# Altium project SpaceSalmon.PrjPcb (part 1 of 2)
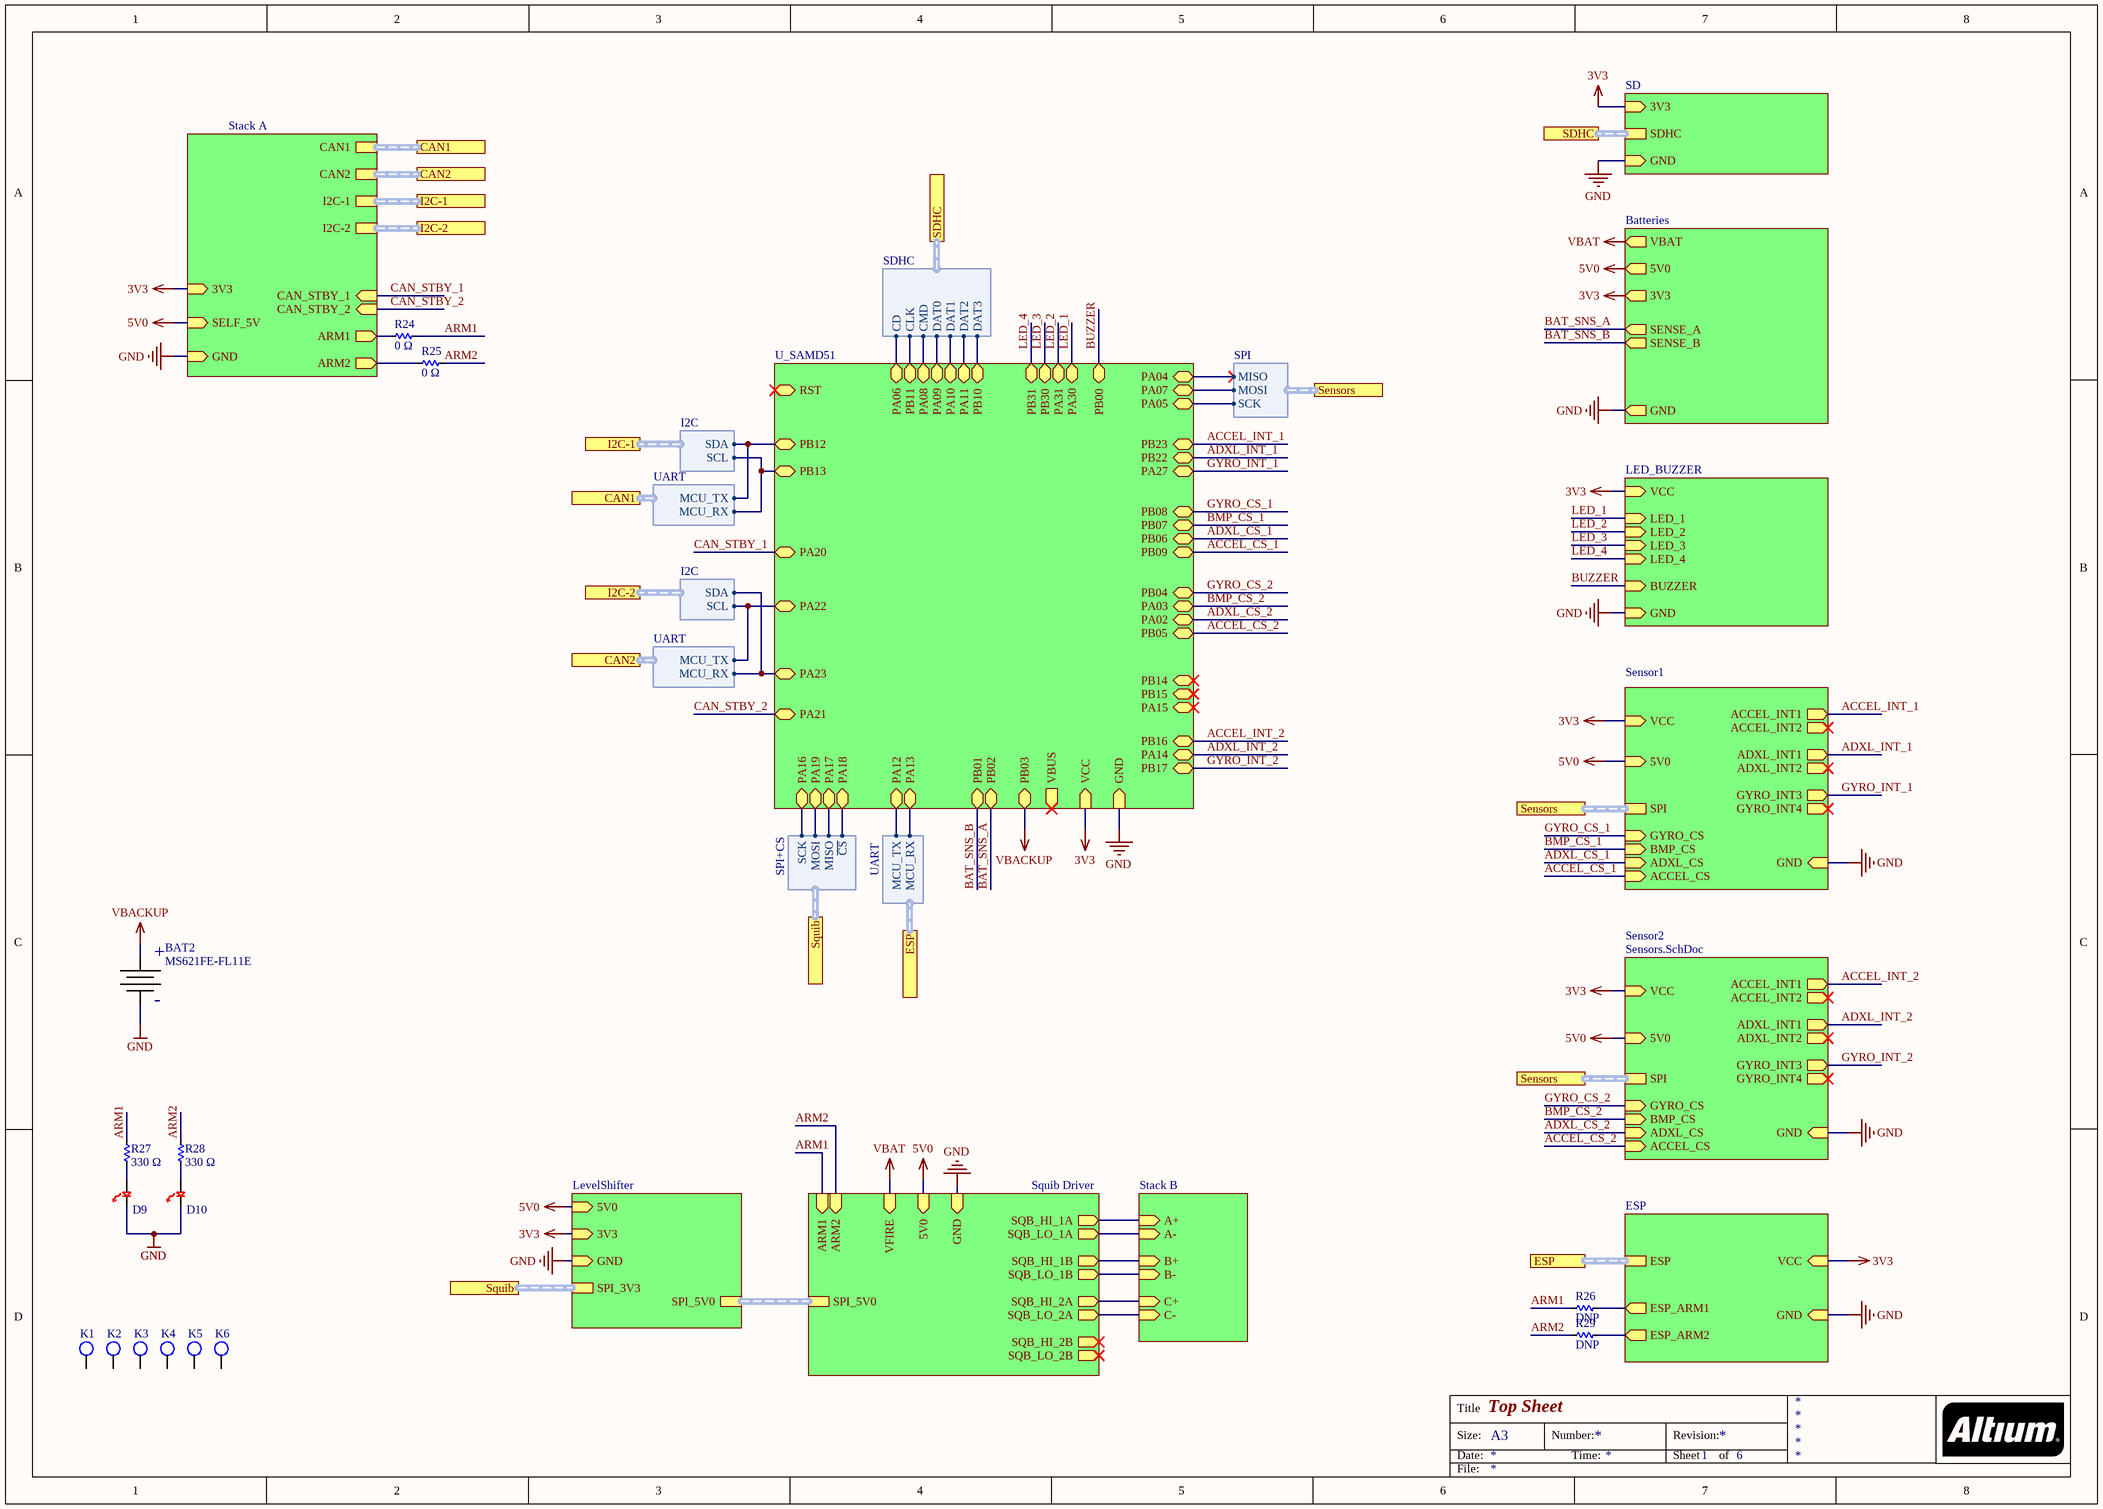
[diagram p0: Salmon.SchDoc]
prjEngineer1: John Dean; prjEngineer2: Rebecca Wong; prjReviewDate: 2016-10-31; prjReviewer: Sasha Maldonado; prjRevision: 0; prjTitle: IREC SRAD Altimeter
10 sheets, 173 parts. Net scope: strictly hierarchical (ports join the sheet entries above them; power ports are local).
Board file: Salmon.PcbDoc
Sheets:
  Salmon.SchDoc
    Sensor1 = Sensors.SchDoc
    Batteries = Battery_Management.SchDoc
    LED_BUZZER = Blink_Blink_Beep_Boop.SchDoc
    ESP = ESP8266.SchDoc
    U_SAMD51 = SAMD51.SchDoc
    Sensor2 = Sensors.SchDoc
    Stack B = Stack_B.SchDoc
    Stack A = Stack_A.SchDoc
    Squib Driver = MC33797.SchDoc
    SD = SD.SchDoc

## Sheet Salmon.SchDoc: Top Sheet
size A3; SheetNumber: 1; SheetTotal: 6; DocumentName: Top Sheet

### Parts
BAT2  MS621FE-FL11E  [BATT_COINCELL_RECHARGEABLE]
D9  RED  [0805_Diode]  (value not drawn)
D10  RED  [0805_Diode]  (value not drawn)
K1  92985A610  [#4_PRESSFIT_FOOT_1/4]  (value not drawn)
K2  92985A610  [#4_PRESSFIT_FOOT_1/4]  (value not drawn)
K3  92985A610  [#4_PRESSFIT_FOOT_1/4]  (value not drawn)
K4  92985A610  [#4_PRESSFIT_FOOT_1/4]  (value not drawn)
K5  92985A610  [#4_PRESSFIT_FOOT_1/4]  (value not drawn)
K6  92985A610  [#4_PRESSFIT_FOOT_1/4]  (value not drawn)
R24  Resistance: 0 Ω  [R0603]  (hidden comment: __template_resistor)
R25  Resistance: 0 Ω  [R0603]  (hidden comment: __template_resistor)
R26  Resistance: DNP  [R0603]  (hidden comment: __template_resistor)
R27  Resistance: 330 Ω  [R0603]  (hidden comment: __template_resistor)
R28  Resistance: 330 Ω  [R0603]  (hidden comment: __template_resistor)
R29  Resistance: DNP  [R0603]  (hidden comment: __template_resistor)

### Sub-sheets
Batteries = Battery_Management: SENSE_A (out), SENSE_B (out), 5V0 (out), GND (out), 3V3 (out), VBAT (out)
ESP = ESP8266.SchDoc: ESP_ARM2 (out), ESP_ARM1 (out), VCC (in), GND (in), ESP (harness UART)
LED_BUZZER = Blink_Blink_Beep_Boop: LED_1 (in), LED_2 (in), LED_3 (in), LED_4 (in), BUZZER (in), GND (in), VCC (in)
LevelShifter = LevelShifter.SchDoc (file not in this document): SPI_3V3 (harness SPI+CS), SPI_5V0 (harness SPI+CS), 5V0 (in), 3V3 (in), GND (in)
SD = SD.SchDoc: SDHC (harness SDHC), GND (in), 3V3 (in)
Sensor1 = Sensors.SchDoc: SPI (harness SPI), GYRO_CS (in), BMP_CS (in), ADXL_CS (in), ACCEL_CS (in), ACCEL_INT1 (out), ACCEL_INT2 (out), ADXL_INT1 (out), ADXL_INT2 (out), GYRO_INT3 (out), GYRO_INT4 (out), GND (in), VCC (in), 5V0 (in)
Sensor2 = Sensors.SchDoc: SPI (harness SPI), GYRO_CS (in), BMP_CS (in), ADXL_CS (in), ACCEL_CS (in), ACCEL_INT1 (out), ACCEL_INT2 (out), ADXL_INT1 (out), ADXL_INT2 (out), GYRO_INT3 (out), GYRO_INT4 (out), GND (in), VCC (in), 5V0 (in)
Squib Driver = MC33797.SchDoc: SPI_5V0 (harness SPI+CS), SQB_LO_1A (out), SQB_HI_1A (out), SQB_LO_1B (out), SQB_HI_1B (out), SQB_HI_2A (out), SQB_LO_2A (out), ARM1 (in), ARM2 (in), 5V0 (in), VFIRE (in), GND (in), SQB_HI_2B (out), SQB_LO_2B (out)
Stack A = Stack_A.SchDoc: CAN2 (harness UART), I2C-2 (harness I2C), I2C-1 (harness I2C), CAN1 (harness UART), CAN_STBY_2 (in), CAN_STBY_1 (in), ARM1 (out), ARM2 (out), GND (in), SELF_5V (in), 3V3 (in)
Stack B = Stack_B.SchDoc: B- (in), C+ (in), B+ (in), A- (in), A+ (in), C- (in)
U_SAMD51 = SAMD51.SchDoc: PA12 (bidir), PA13 (bidir), PA05 (bidir), PA07 (bidir), PA04 (bidir), PA06 (bidir), PB11 (bidir), PA08 (bidir), PA09 (bidir), PA10 (bidir), PA11 (bidir), PB10 (bidir), PB12 (bidir), PB13 (bidir), PA22 (bidir), PA23 (bidir), PA16 (bidir), PA19 (bidir), PA17 (bidir), PA20 (bidir), PA21 (bidir), PB08 (bidir), PB07 (bidir), PB06 (bidir), PB09 (bidir), PB04 (bidir), PA03 (bidir), PA02 (bidir), PB05 (bidir), PB00 (bidir), PB30 (bidir), PA31 (bidir), PA30 (bidir), PB31 (bidir), PB16 (bidir), PA14 (bidir), PB17 (bidir), PB23 (bidir), PB22 (bidir), PA27 (bidir), PB02 (bidir), PB01 (bidir), PB03 (bidir), PA18 (bidir), GND (in), VCC (in), VBUS (out), PB14 (bidir), PB15 (bidir), PA15 (bidir), RST (bidir)

### Ports
CAN1 (harness UART), CAN2 (harness UART), ESP (harness UART), I2C-1 (harness I2C), I2C-2 (harness I2C), SDHC, SDHC (harness SDHC), Sensors (harness SPI), Squib (harness SPI+CS)

### Harnesses
UART: MCU_TX, MCU_RX
SPI: MISO, MOSI, SCK
SDHC: CD, CLK, CMD, DAT0, DAT1, DAT2, DAT3
I2C: SCL, SDA
UART: MCU_RX, MCU_TX
SPI+CS: MISO, MOSI, SCK, ~{CS}

### Nets
3V3: sheet Sensor1/VCC, sheet Batteries/3V3, sheet LED_BUZZER/VCC, sheet ESP/VCC, sheet U_SAMD51/VCC, sheet Sensor2/VCC, sheet Stack A/3V3, sheet LevelShifter/3V3, sheet SD/3V3
5V0: sheet Sensor1/5V0, sheet Batteries/5V0, sheet Sensor2/5V0, sheet Stack A/SELF_5V, sheet Squib Driver/5V0, sheet LevelShifter/5V0
GND: BAT2.- D9.1 D10.1 ; sheet Sensor1/GND, sheet Batteries/GND, sheet LED_BUZZER/GND, sheet ESP/GND, sheet U_SAMD51/GND, sheet Sensor2/GND, sheet Stack A/GND, sheet Squib Driver/GND, sheet LevelShifter/GND, sheet SD/GND  [project net SELF_GND]
VBACKUP: BAT2.+ ; sheet U_SAMD51/PB03
VBAT: sheet Batteries/VBAT, sheet Squib Driver/VFIRE
ACCEL_CS_1: sheet Sensor1/ACCEL_CS, sheet U_SAMD51/PB09
ACCEL_CS_2: sheet U_SAMD51/PB05, sheet Sensor2/ACCEL_CS
ACCEL_INT_1: sheet Sensor1/ACCEL_INT1, sheet U_SAMD51/PB23
ACCEL_INT_2: sheet U_SAMD51/PB16, sheet Sensor2/ACCEL_INT1
ADXL_CS_1: sheet Sensor1/ADXL_CS, sheet U_SAMD51/PB06
ADXL_CS_2: sheet U_SAMD51/PA02, sheet Sensor2/ADXL_CS
ADXL_INT_1: sheet Sensor1/ADXL_INT1, sheet U_SAMD51/PB22
ADXL_INT_2: sheet U_SAMD51/PA14, sheet Sensor2/ADXL_INT1
ARM1: R24.2 R26.1 R27.2 ; sheet Squib Driver/ARM1
ARM2: R25.2 R28.2 R29.1 ; sheet Squib Driver/ARM2
BAT_SNS_A: sheet Batteries/SENSE_A, sheet U_SAMD51/PB02
BAT_SNS_B: sheet Batteries/SENSE_B, sheet U_SAMD51/PB01
BMP_CS_1: sheet Sensor1/BMP_CS, sheet U_SAMD51/PB07
BMP_CS_2: sheet U_SAMD51/PA03, sheet Sensor2/BMP_CS
BUZZER: sheet LED_BUZZER/BUZZER, sheet U_SAMD51/PB00
CAN_STBY_1: sheet U_SAMD51/PA20, sheet Stack A/CAN_STBY_1
CAN_STBY_2: sheet U_SAMD51/PA21, sheet Stack A/CAN_STBY_2
GYRO_CS_1: sheet Sensor1/GYRO_CS, sheet U_SAMD51/PB08
GYRO_CS_2: sheet U_SAMD51/PB04, sheet Sensor2/GYRO_CS
GYRO_INT_1: sheet Sensor1/GYRO_INT3, sheet U_SAMD51/PA27
GYRO_INT_2: sheet U_SAMD51/PB17, sheet Sensor2/GYRO_INT3
LED_1: sheet LED_BUZZER/LED_1, sheet U_SAMD51/PA30
LED_2: sheet LED_BUZZER/LED_2, sheet U_SAMD51/PA31
LED_3: sheet LED_BUZZER/LED_3, sheet U_SAMD51/PB30
LED_4: sheet LED_BUZZER/LED_4, sheet U_SAMD51/PB31
MISO: sheet U_SAMD51/PA04, port Sensors.MISO
MOSI: sheet U_SAMD51/PA07, port Sensors.MOSI
SCK: sheet U_SAMD51/PA05, port Sensors.SCK
SD_CD: sheet U_SAMD51/PA06, port SDHC.CD
SD_CLK: sheet U_SAMD51/PB11, port SDHC.CLK
SD_CMD: sheet U_SAMD51/PA08, port SDHC.CMD
SD_DAT0: sheet U_SAMD51/PA09, port SDHC.DAT0
SD_DAT1: sheet U_SAMD51/PA10, port SDHC.DAT1
SD_DAT2: sheet U_SAMD51/PA11, port SDHC.DAT2
SD_DAT3: sheet U_SAMD51/PB10, port SDHC.DAT3
SELF_A+: sheet Stack B/A+, sheet Squib Driver/SQB_HI_1A
SELF_A-: sheet Stack B/A-, sheet Squib Driver/SQB_LO_1A
SELF_ARM1: R24.1 ; sheet Stack A/ARM1
SELF_ARM2: R25.1 ; sheet Stack A/ARM2
SELF_B+: sheet Stack B/B+, sheet Squib Driver/SQB_HI_1B
SELF_B-: sheet Stack B/B-, sheet Squib Driver/SQB_LO_1B
SELF_C+: sheet Stack B/C+, sheet Squib Driver/SQB_HI_2A
SELF_C-: sheet Stack B/C-, sheet Squib Driver/SQB_LO_2A
NetCANA1_1: sheet U_SAMD51/PB13, port I2C-1.SCL, port CAN1.MCU_RX
NetCANA1_4: sheet U_SAMD51/PB12, port I2C-1.SDA, port CAN1.MCU_TX
NetCANB1_1: sheet U_SAMD51/PA23, port I2C-2.SDA, port CAN2.MCU_RX
NetCANB1_4: sheet U_SAMD51/PA22, port I2C-2.SCL, port CAN2.MCU_TX
NetD9_2: D9.2 R27.1
NetD10_2: D10.2 R28.1
NetJ1_1: sheet U_SAMD51/PA13, port ESP.MCU_RX
NetJ1_2: sheet U_SAMD51/PA12, port ESP.MCU_TX
NetR19_1: R26.2 ; sheet ESP/ESP_ARM1
NetR22_1: R29.2 ; sheet ESP/ESP_ARM2
NetU12_35: sheet U_SAMD51/PA16, port Squib.SCK
NetU12_36: sheet U_SAMD51/PA17, port Squib.MISO
NetU12_37: sheet U_SAMD51/PA18, port Squib.~{CS}
NetU12_38: sheet U_SAMD51/PA19, port Squib.MOSI

Not connected (* = marked no-connect by the designer): K1 1; K2 1; K3 1; K4 1; K5 1; K6 1

### Buses and harness runs
harness port CAN1 = sheet Stack A/CAN1
harness port CAN2 = sheet Stack A/CAN2
harness port ESP = sheet ESP/ESP
harness port I2C-1 = sheet Stack A/I2C-1
harness port I2C-2 = sheet Stack A/I2C-2
harness port SDHC = sheet SD/SDHC
harness port Sensors = sheet Sensor1/SPI
harness port Sensors = sheet Sensor2/SPI
harness port Squib = sheet LevelShifter/SPI_3V3
harness sheet LevelShifter/SPI_5V0 = sheet Squib Driver/SPI_5V0

### Notes on the sheet
- Title
- Size:
- Date:
- A3
- Number:
- Time:
- Revision:
- Sheet
- of
- File:

### Library data of the parts
BAT2 = BAT_MS621FE: MS621FE RECHARGEABLE COIN CELL BACKUP; Manufacturer: Seiko Instruments; Battery Chemistry: Lithium; Battery Cell Size: Coin, 6.8mm; Capacity: 5.5mAh; Discharge Rate: 15µA; Shipping Info: Due to restrictions, only ground shipment is allowed.; Supplier 1: Digi-Key; Manufacturer Part Number: MS621FE-FL11E; RoHS: RoHS Compliant; Category: Battery Products; Stock 1: 41059; Pricing 1: 1=2.04, 10=1.838, 50=1.6338, 100=1.4296, 250=1.30704, 500=1.22534, 1000=1.09051, 2500=1.0112, 5000=0.99138 (USD); Part Status: Active; Size / Dimension: 0.27" Dia x 0.08" H (6.8mm x 2.1mm); Termination Style: SMD (SMT) Tab; Standard Charge Current: 15µA; Standard Charge Time: -; Weight: 0.23g; ComponentLink1URL: http://www.sii.co.jp/en/me/files/2017/04/MicroBatteryCatalogue-E_2017_web.pdf; ComponentLink1Description: http://www.sii.co.jp/en/me/files/2017/04/MicroBatteryCatalogue-E_2017_web.pdf; Supplier Part Number 1: 728-1057-ND
D9 D10 = LED_LY974: LED 0805 RED 20MA; Manufacturer: OSRAM Opto Semiconductors Inc; Manufacturer Part Number: LH R974-LP-1; Wavelength - Dominant: 645nm; Wavelength - Peak: 660nm; Millicandela Rating: 41mcd; Voltage - Forward (Vf) (Typ): 1.8V; Viewing Angle: 160°; Lens Transparency: Diffused; Lens Color: White; Lens Style/Size: Rectangle with Flat Top, 1.30mm x 1.25mm; Supplier 1: Digi-Key; RoHS: RoHS Compliant; Category: Optoelectronics; Stock 1: 66379; Pricing 1: 1=0.08, 10=0.07, 100=0.0559, 250=0.04892, 500=0.04472 (USD); Packaging: Cut Tape (CT); Color: Red; Package / Case: 0805 (2012 Metric); Supplier Device Package: *; Size / Dimension: 2.00mm L x 1.25mm W; Height (Max): 0.80mm; Mounting Type: Surface Mount; ComponentLink1URL: http://www.osram-os.com/Graphics/XPic8/00078869_0.pdf; ComponentLink1Description: http://www.osram-os.com/Graphics/XPic8/00078869_0.pdf; Supplier Part Number 1: 475-1415-1-ND; Current - Test: 20mA
K1-K6 = #4_PRESSFIT_MOUNTING_FOOT: Press-Fit Unthreaded Spacers, 7/32" OD, 1/8" Long; Supplier Link: https://www.mcmaster.com/#92985a610/=16cb2ec
R24 R25 = RES SMD 0 OHM JUMPER 1/10W 0603: Manufacturer Part Number: RC0603FR-070RL; Manufacturer: Yageo; Resistance (Sortable): 0; Tolerance: Jumper; Power (Watts): 0.1W, 1/10W; Supplier 1: Digikey; Datasheets: http://www.yageo.com/documents/recent/PYu-RC_Group_51_RoHS_L_9.pdf; Image: //media.digikey.com/Renders/Yageo%20Renders/0603-(1608-Metric).jpg; Supplier Part Number 1: 311-0.0HRCT-ND; Temperature Coefficient: -; Operating Temperature: -55°C ~ 155°C
R26 R29 = RES SMD DNP 0603: Resistance (Sortable): DNP
R27 R28 = RES SMD 330 OHM 1% 1/10W 0603: Manufacturer Part Number: RC0603FR-07330RL; Manufacturer: Yageo; Resistance (Sortable): 330; Tolerance: ±1%; Power (Watts): 0.1W, 1/10W; Temperature Coefficient: ±100ppm/°C; Supplier 1: Digikey; Datasheets: http://www.yageo.com/documents/recent/PYu-RC_Group_51_RoHS_L_9.pdf; Image: //media.digikey.com/Renders/Yageo%20Renders/0603-(1608-Metric).jpg; Supplier Part Number 1: 311-330HRCT-ND; Operating Temperature: -55°C ~ 155°C

## Sheet Sensors.SchDoc
size A4
Used 2 times, as channels Sensor1, Sensor2. Parts and nets are listed once, with the designators drawn on the sheet.
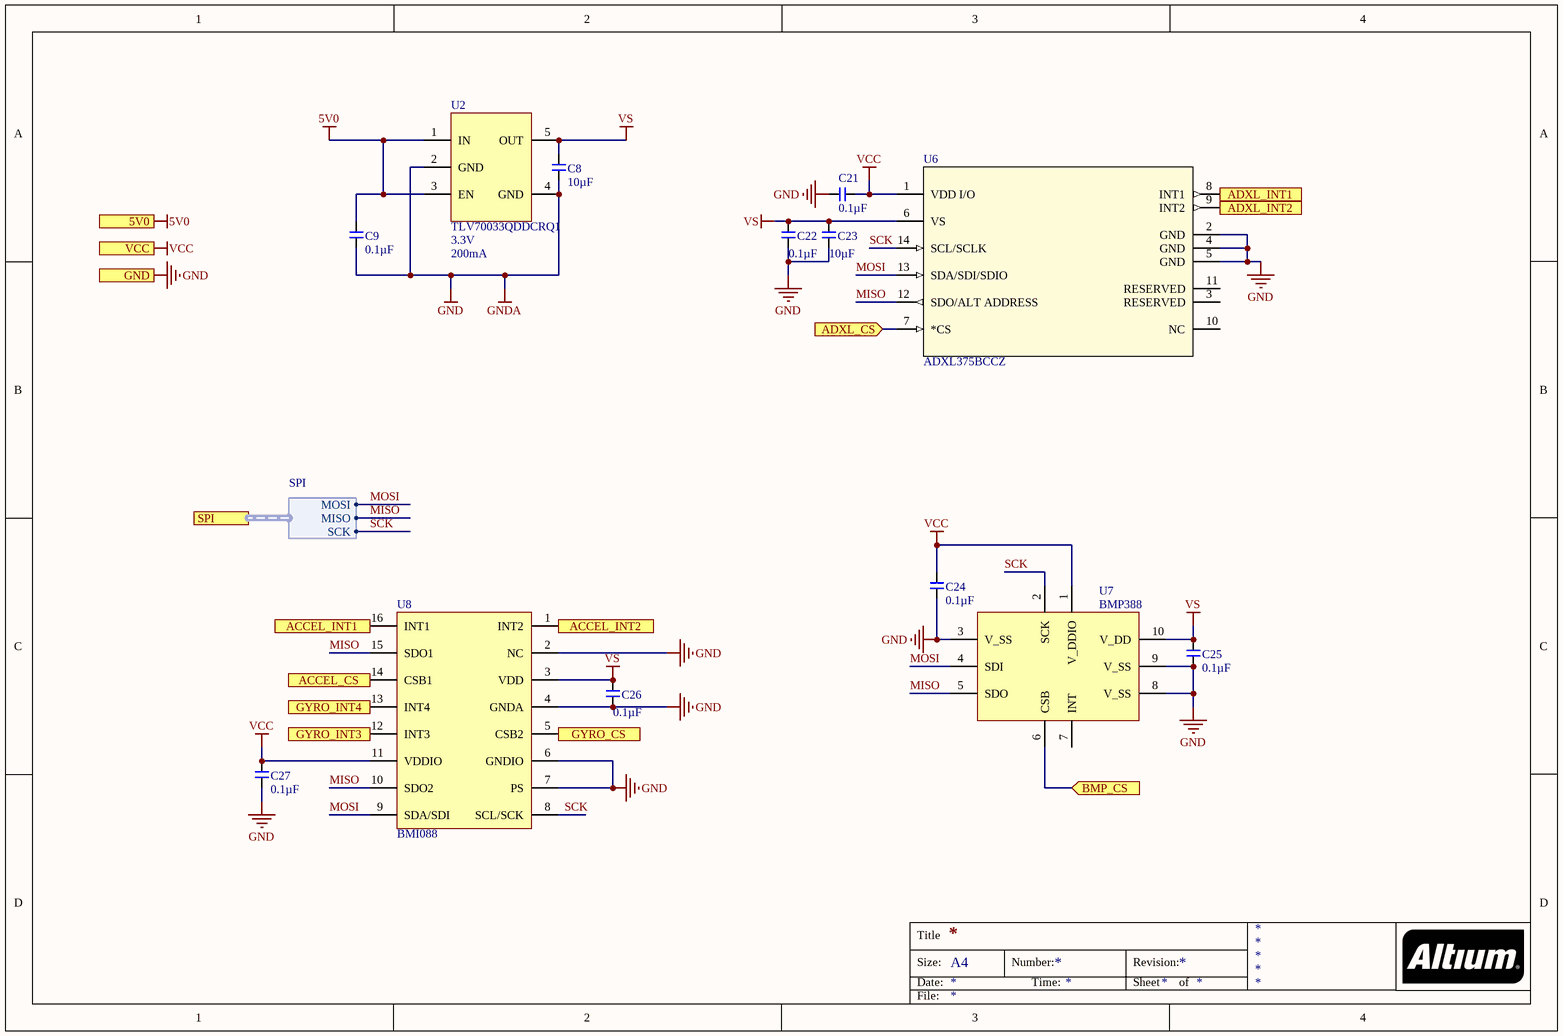
[diagram p1: Sensors.SchDoc]

### Parts
C8  Capacitance (shorthand): 10µF  [C0603]  (hidden comment: __template_cap)
C9  Capacitance (shorthand): 0.1µF  [C0603]  (hidden comment: __template_cap)
C21  Capacitance (shorthand): 0.1µF  [C0603]  (hidden comment: __template_cap)
C22  Capacitance (shorthand): 0.1µF  [C0603]  (hidden comment: __template_cap)
C23  Capacitance (shorthand): 10µF  [C0603]  (hidden comment: __template_cap)
C24  Capacitance (shorthand): 0.1µF  [C0603]  (hidden comment: __template_cap)
C25  Capacitance (shorthand): 0.1µF  [C0603]  (hidden comment: __template_cap)
C26  Capacitance (shorthand): 0.1µF  [C0603]  (hidden comment: __template_cap)
C27  Capacitance (shorthand): 0.1µF  [C0603]  (hidden comment: __template_cap)
U2  Manufacturer Part Number: TLV70033QDDCRQ1  Voltage - Output: 3.3V  Current - Output: 200mA  [5SOT23]  (hidden comment: REG102GA-3.3)
U6  ADXL375BCCZ  [LGA_CC-14-1]
U7  BMP388  [8 pin LGA]
U8  BMI088  [BMI088]

### Ports
5V0 (in), ACCEL_CS (in), ACCEL_INT1 (out), ACCEL_INT2 (out), ADXL_CS (in), ADXL_INT1 (out), ADXL_INT2 (out), BMP_CS (in), GND (in), GYRO_CS (in), GYRO_INT3 (out), GYRO_INT4 (out), SPI (harness SPI), VCC (in)

### Harnesses
SPI: MISO, MOSI, SCK

### Nets
5V0: C9.1 U2.1(IN) U2.3(EN) ; port 5V0
GND: C8.2 C9.2 C21.2 C22.1 C23.2 C24.2 C25.2 C26.2 C27.2 U2.2(GND) U2.4(GND) U6.2(GND) U6.4(GND) U6.5(GND) U7.3(V_SS) U7.8(V_SS) U7.9(V_SS) U8.2(NC) U8.4(GNDA) U8.6(GNDIO) U8.7(PS) ; port GND  [also labelled GNDA]
VCC: C21.1 C24.1 C27.1 U6.1(VDD_I/O) U7.1(V_DDIO) U8.11(VDDIO) ; port VCC
VS: C8.1 C22.2 C23.1 C25.1 C26.1 U2.5(OUT) U6.6(VS) U7.10(V_DD) U8.3(VDD)
ACCEL_CS: U8.14(CSB1) ; port ACCEL_CS
ACCEL_INT1: U8.16(INT1) ; port ACCEL_INT1
ACCEL_INT2: U8.1(INT2) ; port ACCEL_INT2
ADXL_CS: U6.7(*CS) ; port ADXL_CS
ADXL_INT1: U6.8(INT1) ; port ADXL_INT1
ADXL_INT2: U6.9(INT2) ; port ADXL_INT2
BMP_CS: U7.6(CSB) ; port BMP_CS
GYRO_CS: U8.5(CSB2) ; port GYRO_CS
GYRO_INT3: U8.12(INT3) ; port GYRO_INT3
GYRO_INT4: U8.13(INT4) ; port GYRO_INT4
MISO: U6.12(SDO/ALT_ADDRESS) U7.5(SDO) U8.10(SDO2) U8.15(SDO1) ; port SPI.MISO
MOSI: U6.13(SDA/SDI/SDIO) U7.4(SDI) U8.9(SDA/SDI) ; port SPI.MOSI
SCK: U6.14(SCL/SCLK) U7.2(SCK) U8.8(SCL/SCK) ; port SPI.SCK

Not connected (* = marked no-connect by the designer): U6 3(RESERVED) 10(NC) 11(RESERVED); U7 7(INT)

### Channels
Sensor1: designators end in -1; ports 5V0=5V0 ACCEL_CS=ACCEL_CS_1 ACCEL_INT1=ACCEL_INT_1 ACCEL_INT2=NetU8-1_1 ADXL_CS=ADXL_CS_1 ADXL_INT1=ADXL_INT_1 ADXL_INT2=NetU6-1_9 BMP_CS=BMP_CS_1 GND=SELF_GND GYRO_CS=GYRO_CS_1 GYRO_INT3=GYRO_INT_1 GYRO_INT4=NetU8-1_13 VCC=3V3
Sensor2: designators end in -2; ports 5V0=5V0 ACCEL_CS=ACCEL_CS_2 ACCEL_INT1=ACCEL_INT_2 ACCEL_INT2=NetU8-2_1 ADXL_CS=ADXL_CS_2 ADXL_INT1=ADXL_INT_2 ADXL_INT2=NetU6-2_9 BMP_CS=BMP_CS_2 GND=SELF_GND GYRO_CS=GYRO_CS_2 GYRO_INT3=GYRO_INT_2 GYRO_INT4=NetU8-2_13 VCC=3V3

### Notes on the sheet
- Title
- Size:
- Date:
- A4
- Number:
- Time:
- Revision:
- Sheet
- of
- File:

### Library data of the parts
C8 C23 = CAP CER 10UF 35V X5R 0603 20%: Manufacturer: Murata Electronics North America; Capacitance - pF (Machine readable): 10000000; type: capacitor; Dielectric: X5R; Supplier 1: Digikey; Supplier Part Number 1: 490-13248-1-ND
C9 C21 C22 C24-C27 = CAP CER 0603 0.1µF X7R 50V 10%: Manufacturer: Murata Electronics North America; Capacitance - pF (Machine readable): 100000; type: capacitor; Dielectric: X7R; Supplier 1: Digikey; Supplier Part Number 1: 490-1519-1-ND
U2 = LDO_TLV70033QDDCRQ1: IC REG LDO 3.3V .2A SOT23-5; Manufacturer: Texas Instruments; Regulator Topology: Positive Fixed; Number of Regulators: 1; Voltage - Input: Up to 5.5V; Current - Limit (Min): 220mA; ComponentLink1URL: http://www.ti.com/lit/ds/symlink/tlv70033-q1.pdf; ComponentLink1Description: Datasheet; Supplier 1: Digi-Key; RoHS: RoHS Compliant; Category: Integrated Circuits (ICs); Stock 1: 889; Pricing 1: 1=0.58, 10=0.507, 25=0.444, 100=0.1661, 250=0.16296, 500=0.1599, 750=0.15683 (USD); Packaging: Cut Tape (CT); Voltage - Dropout (Typical): -; Operating Temperature: -40°C ~ 125°C; Mounting Type: Surface Mount; Package / Case: SOT-23-5 Thin, TSOT-23-5; Supplier Device Package: SOT-5; Supplier Part Number 1: 296-27780-1-ND
U6 = ADXL375BCCZ: 200G Accelcerometer; Value: Value; Type: Type; RefDes: RefDes; ComponentLink1Description: Datasheet; ComponentLink1URL: http://www.analog.com/media/en/technical-documentation/data-sheets/ADXL375.PDF
U7 = BMP388: Pressure Sensor 4.35 PSI ~ 18.13 PSI (30 kPa ~ 125 kPa) Absolute 10-WFLGA; Manufacturer: Bosch Sensortec; Supplier 1: Digi-Key; Manufacturer Part Number: BMP388; Stock 1: 46050; Pricing 1: 1=3.93, 5=3.466, 10=3.061, 25=2.4832, 50=2.1946, 100=2.1368, 500=1.7903, 1000=1.6748, 5000=1.5593 (USD); ComponentLink1URL: https://ae-bst.resource.bosch.com/media/_tech/media/product_flyer/BST-BMP388-FL000-00.pdf; ComponentLink1Description: https://ae-bst.resource.bosch.com/media/_tech/media/product_flyer/BST-BMP388-FL000-00.pdf
U8 = IMU_BMI088: Bosch BMI088; Supplier 1: Digi-Key; Supplier Part Number 1: 828-1082-1-ND; ComponentLink1Description: Datasheet; ComponentLink1URL: https://ae-bst.resource.bosch.com/media/_tech/media/datasheets/BST-BMI088-DS001-13.pdf

## Sheet Battery_Management.SchDoc: Battery Management
size A3; SheetNumber: 4; SheetTotal: 6
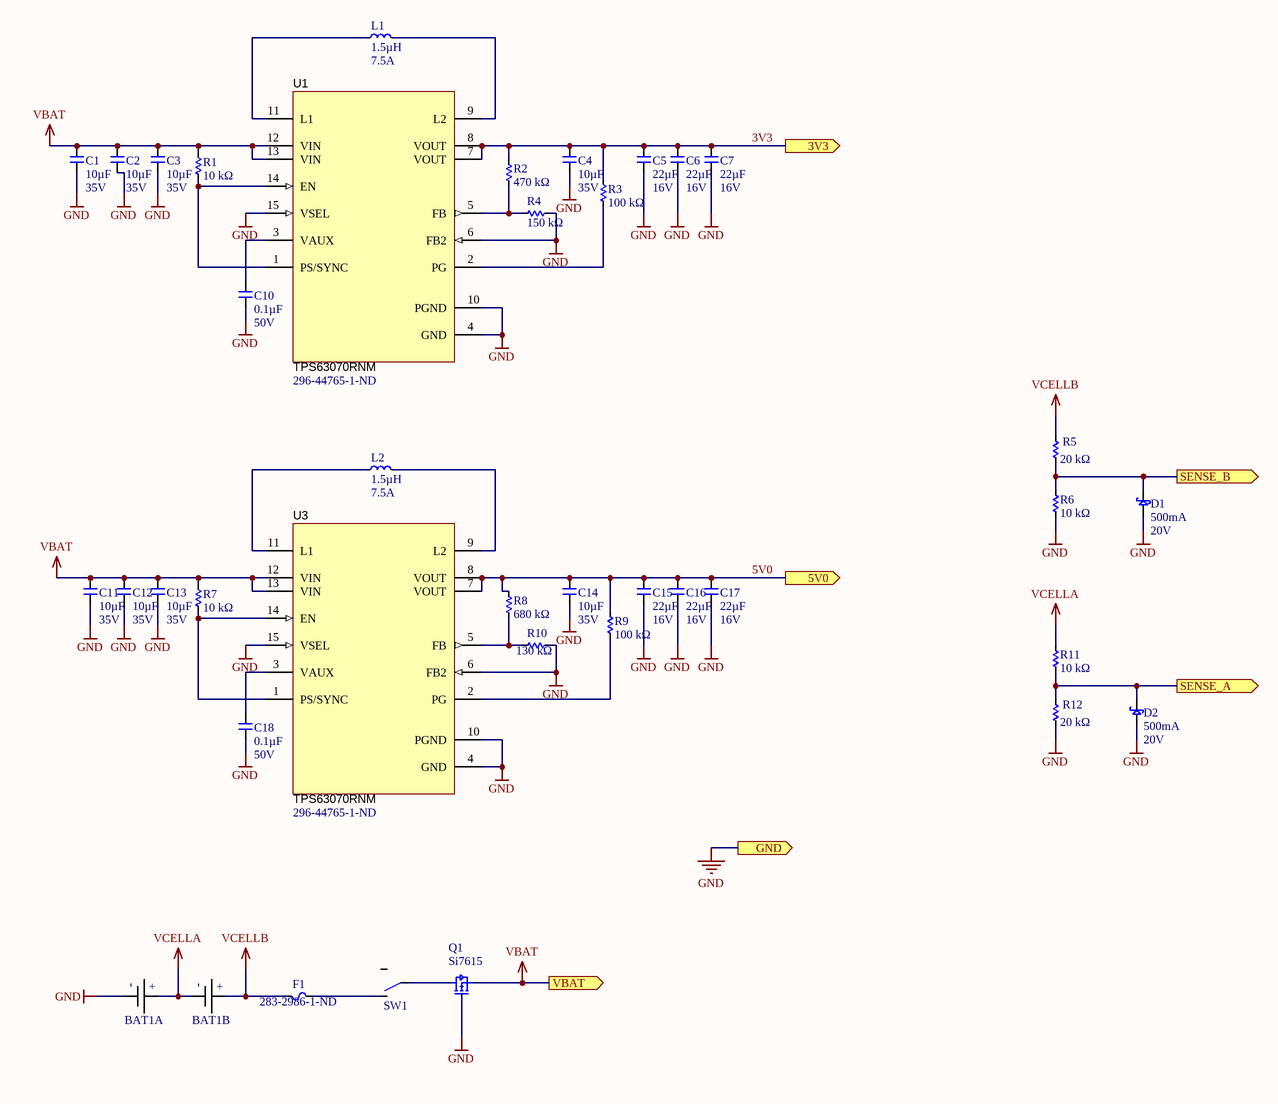
[diagram p2: Battery_Management.SchDoc]

### Parts
BAT1  BATT_Clip_Li-Ion_2x  [BATT_18650_KEYSTONE_1048]  (value not drawn)  (parts A,B of 2)
C1  Capacitance (shorthand): 10µF  Rated Voltage: 35V  [C0603]  (hidden comment: __template_cap)
C2  Capacitance (shorthand): 10µF  Rated Voltage: 35V  [C0603]  (hidden comment: __template_cap)
C3  Capacitance (shorthand): 10µF  Rated Voltage: 35V  [C0603]  (hidden comment: __template_cap)
C4  Capacitance (shorthand): 10µF  Rated Voltage: 35V  [C0603]  (hidden comment: __template_cap)
C5  Capacitance (shorthand): 22µF  Rated Voltage: 16V  [C0603]  (hidden comment: __template_cap)
C6  Capacitance (shorthand): 22µF  Rated Voltage: 16V  [C0603]  (hidden comment: __template_cap)
C7  Capacitance (shorthand): 22µF  Rated Voltage: 16V  [C0603]  (hidden comment: __template_cap)
C10  Capacitance (shorthand): 0.1µF  Rated Voltage: 50V  [C0603]  (hidden comment: __template_cap)
C11  Capacitance (shorthand): 10µF  Rated Voltage: 35V  [C0603]  (hidden comment: __template_cap)
C12  Capacitance (shorthand): 10µF  Rated Voltage: 35V  [C0603]  (hidden comment: __template_cap)
C13  Capacitance (shorthand): 10µF  Rated Voltage: 35V  [C0603]  (hidden comment: __template_cap)
C14  Capacitance (shorthand): 10µF  Rated Voltage: 35V  [C0603]  (hidden comment: __template_cap)
C15  Capacitance (shorthand): 22µF  Rated Voltage: 16V  [C0603]  (hidden comment: __template_cap)
C16  Capacitance (shorthand): 22µF  Rated Voltage: 16V  [C0603]  (hidden comment: __template_cap)
C17  Capacitance (shorthand): 22µF  Rated Voltage: 16V  [C0603]  (hidden comment: __template_cap)
C18  Capacitance (shorthand): 0.1µF  Rated Voltage: 50V  [C0603]  (hidden comment: __template_cap)
D1  Current - Average Rectified (Io): 500mA  Voltage - DC Reverse (Vr) (Max): 20V  [SOD123]  (hidden comment: SCHOTTKY_MBR0520L)
D2  Current - Average Rectified (Io): 500mA  Voltage - DC Reverse (Vr) (Max): 20V  [SOD123]  (hidden comment: SCHOTTKY_MBR0520L)
F1  Supplier Part Number 1: 283-2986-1-ND  [R1206]  (hidden comment: __template_fuse)
L1  Inductance: 1.5µH  Current Rating: 7.5A  [SMD5230]  (hidden comment: IND_IHLP2020CZER1R5M11)
L2  Inductance: 1.5µH  Current Rating: 7.5A  [SMD5230]  (hidden comment: IND_IHLP2020CZER1R5M11)
Q1  Si7615  [POWERPAK_1212-8_SINGLE]
R1  Resistance: 10 kΩ  [R0603]  (hidden comment: __template_resistor)
R2  Resistance: 470 kΩ  [R0603]  (hidden comment: RC0603FR-07470KL)
R3  Resistance: 100 kΩ  [R0603]  (hidden comment: RC0603FR-07100KL)
R4  Resistance: 150 kΩ  [R0603]  (hidden comment: RC0603FR-07150KL)
R5  Resistance: 20 kΩ  [R0603]  (hidden comment: __template_resistor)
R6  Resistance: 10 kΩ  [R0603]  (hidden comment: __template_resistor)
R7  Resistance: 10 kΩ  [R0603]  (hidden comment: __template_resistor)
R8  Resistance: 680 kΩ  [R0603]  (hidden comment: RC0603FR-07680KL)
R9  Resistance: 100 kΩ  [R0603]  (hidden comment: RC0603FR-07100KL)
R10  Resistance: 130 kΩ  [R0603]  (hidden comment: RC0603FR-07130KL)
R11  Resistance: 10 kΩ  [R0603]  (hidden comment: __template_resistor)
R12  Resistance: 20 kΩ  [R0603]  (hidden comment: __template_resistor)
SW1  (no value)  [SWITCH_500SSP1S1M6QEA]
U1  TPS63070RNM  Supplier Part Number 1: 296-44765-1-ND  [TPS63070]
U3  TPS63070RNM  Supplier Part Number 1: 296-44765-1-ND  [TPS63070]

### Ports
3V3 (out), 5V0 (out), GND (out), SENSE_A (out), SENSE_B (out), VBAT (out)

### Nets
3V3: C4.1 C5.1 C6.1 C7.1 R2.2 R3.2 U1.7(VOUT) U1.8(VOUT) ; port 3V3
5V0: C14.1 C15.1 C16.1 C17.1 R8.2 R9.2 U3.7(VOUT) U3.8(VOUT) ; port 5V0
GND: BAT1.CELL1- C1.2 C2.2 C3.2 C4.2 C5.2 C6.2 C7.2 C10.2 C11.2 C12.2 C13.2 C14.2 C15.2 C16.2 C17.2 C18.2 D1.1 D2.1 Q1.1 R4.2 R6.1 R10.2 R12.1 U1.4(GND) U1.6(FB2) U1.10(PGND) U1.15(VSEL) U3.4(GND) U3.6(FB2) U3.10(PGND) U3.15(VSEL) ; port GND  [project net SELF_GND]
VBAT: C1.1 C2.1 C3.1 C11.1 C12.1 C13.1 Q1.2 R1.2 R7.2 U1.12(VIN) U1.13(VIN) U3.12(VIN) U3.13(VIN) ; port VBAT
VCELLA: BAT1.CELL1+ BAT1.CELL2- R11.2
VCELLB: BAT1.CELL2+ F1.1 R5.2
BAT_SNS_A: D2.2 R11.1 R12.2 ; port SENSE_A
BAT_SNS_B: D1.2 R5.1 R6.2 ; port SENSE_B
NetC10_1: C10.1 U1.3(VAUX)
NetC18_1: C18.1 U3.3(VAUX)
NetF1_2: F1.2 SW1.3
NetL1_1: L1.1 U1.11(L1)
NetL1_2: L1.2 U1.9(L2)
NetL2_1: L2.1 U3.11(L1)
NetL2_2: L2.2 U3.9(L2)
NetQ1_3: Q1.3 SW1.2
NetR1_1: R1.1 U1.1(PS/SYNC) U1.14(EN)
NetR2_1: R2.1 R4.1 U1.5(FB)
NetR3_1: R3.1 U1.2(PG)
NetR7_1: R7.1 U3.1(PS/SYNC) U3.14(EN)
NetR8_1: R8.1 R10.1 U3.5(FB)
NetR9_1: R9.1 U3.2(PG)

Not connected (* = marked no-connect by the designer): SW1 1

### Notes on the sheet
- Title
- Size:
- Date:
- A3
- Number:
- Time:
- Revision:
- Sheet
- of
- File:
- (in symbol BATT_Clip_Li-Ion_2x, part A) +
- (in symbol BATT_Clip_Li-Ion_2x, part B) +

### Library data of the parts
BAT1 = BATT_Clip_Li-Ion_2x: Dual Lithium Ion Cell Holder; Manufacturer: Keystone Electronics; Manufacturer Part Number: 1048P; Battery Type, Function: Cylindrical, Holder; Style: Holder (Open); Battery Cell Size: 18650; Number of Cells: 2; Supplier 1: Digi-Key; RoHS: RoHS Compliant; Category: Battery Products; Stock 1: 759; Pricing 1: 1=4.81, 10=4.007, 50=3.506, 100=3.339, 250=2.92164, 500=2.83816, 1000=2.42078, 2500=2.25382, 5000=2.24047 (USD); Battery Series: -; Mounting Type: PCB, Surface Mount; Termination Style: SMD (SMT) Tab; Height Above Board: 0.585" (14.86mm); Operating Temperature: -50°C ~ 145°C; ComponentLink1URL: http://www.keyelco.com/product-pdf.cfm?p=13959; ComponentLink1Description: http://www.keyelco.com/product-pdf.cfm?p=13959; Supplier 2: Digi-Key
C1-C4 C11-C14 = CAP CER 10UF 35V X5R 0603 20%: as C8 on sheet Sensors; Supplier 1: Digikey; Supplier Part Number 1: 490-13248-1-ND
C5-C7 C15-C17 = CAP CER 22UF 16V X5R 0603 20%: Manufacturer: Samsung Electro-Mechanics; Capacitance - pF (Machine readable): 22000000; type: capacitor; Dielectric: X5R; Supplier 1: Digikey; Supplier Part Number 1: 1276-7076-1-ND
C10 C18 = CAP CER 0603 0.1µF X7R 50V 10%: as C9 on sheet Sensors; Supplier 1: Digikey; Supplier Part Number 1: 490-1519-1-ND
D1 D2 = SCHOTTKY_MBR0520L: DIODE SCHOTTKY 0.5A 20V SOD-123; Manufacturer: Fairchild Semiconductor; Speed: Fast Recovery =< 500ns, > 200mA (Io); Current - Reverse Leakage @ Vr: 250µA @ 20V; Voltage - Forward (Vf) (Max) @ If: 385mV @ 500mA; Supplier 1: Digi-Key; Manufacturer Part Number: MBR0520L; RoHS: RoHS Compliant; Category: Discrete Semiconductor Products; Stock 1: 217232; Pricing 1: 1=0.63, 10=0.43, 100=0.2024, 250=0.1442, 500=0.11006, 750=0.08603, 1000=0.0759 (USD); Diode Type: Schottky; Reverse Recovery Time (trr): -; Capacitance @ Vr, F: -; Mounting Type: Surface Mount; Package / Case: SOD-123; Supplier Device Package: SOD-123; Packaging: Cut Tape (CT); ComponentLink1URL: http://www.fairchildsemi.com/ds/MB/MBR0520L.pdf; ComponentLink1Description: Datasheet; Supplier Part Number 1: MBR0520LCT-ND
F1 = __template_fuse: Manufacturer: Eaton; Manufacturer Part Number: CC12H5A-TR; Fuse Type: Board Mount (Cartridge Style Excluded); Current Rating: 5A; Voltage Rating - DC: 32V; Response Time: Slow; Breaking Capacity @ Rated Voltage: 100A; Melting I²t: 6; Approvals: cURus; DC Cold Resistance: 0.021 Ohm; Supplier 1: Digi-Key; RoHS: RoHS Compliant; Category: Circuit Protection; Stock 1: 9201; Pricing 1: 1=0.99, 5=0.954, 10=0.893, 50=0.7392, 100=0.616, 250=0.6006, 500=0.5082, 1000=0.4466 (USD); Packaging: Cut Tape (CT); Part Status: Active; Voltage Rating - AC: -; Package / Case: 1206 (3216 Metric); Mounting Type: Surface Mount; Operating Temperature: -55°C ~ 125°C; Color: -; Size / Dimension: 0.126" L x 0.063" W x 0.024" H (3.20mm x 1.60mm x 0.60mm); ComponentLink1URL: http://www.cooperindustries.com/content/dam/public/bussmann/Electronics/Resources/product-datasheets/Bus_Elx_DS_4309_CC12H_Series.pdf; ComponentLink1Description: http://www.cooperindustries.com/content/dam/public/bussmann/Electronics/Resources/product-datasheets/Bus_Elx_DS_4309_CC12H_Series.pdf
L1 L2 = IND_IHLP2020CZER1R5M11: INDUCTOR POWER 1.5UH 7.5A SMD; Manufacturer: Vishay Dale; Current - Saturation: 7A; Tolerance: ±20%; Shielding: Shielded; DC Resistance (DCR): 18.5 mOhm Max; Frequency - Test: 100kHz; Supplier 1: Digi-Key; Manufacturer Part Number: IHLP2020CZER1R5M11; RoHS: RoHS Compliant; Category: Inductors, Coils, Chokes; Stock 1: 17936; Pricing 1: 1=2.29, 10=1.86, 100=1.55, 500=1.24, 1000=1.116 (USD); Type: -; Material - Core: -; Q @ Freq: -; Frequency - Self Resonant: -; Operating Temperature: -55°C ~ 125°C; Package / Case: Non Standard; Size / Dimension: 0.216" L x 0.204" W x 0.118" H (5.49mm x 5.18mm x 3.00mm); Mounting Type: Surface Mount; Packaging: Cut Tape (CT); ComponentLink1URL: http://www.vishay.com/docs/34260/lp20cz11.pdf; ComponentLink1Description: Datasheet; Supplier Part Number 1: 541-1235-1-ND
Q1 = PFET_SI7615ADN-T1: MOSFET P-CH 20V 35A PPK; pin to pad: 1>4 2>1 3>5; Manufacturer: Vishay Siliconix; Manufacturer Part Number: SI7615ADN-T1-GE3; FET Type: MOSFET P-Channel, Metal Oxide; FET Feature: Standard; Current - Continuous Drain (Id) @ 25°C: 35A (Tc); Rds On (Max) @ Id, Vgs: 4.4 mOhm @ 20A, 10V; Vgs(th) (Max) @ Id: 1.5V @ 250µA; Gate Charge (Qg) @ Vgs: 183nC @ 10V; Input Capacitance (Ciss) @ Vds: 5590pF @ 10V; Power - Max: 52W; Supplier 1: Digi-Key; Supplier Part Number 1: SI7615ADN-T1-GE3CT-ND; RoHS: RoHS Compliant; Category: Discrete Semiconductor Products; Stock 1: 99744; Pricing 1: 1=0.73, 10=0.646, 25=0.6068, 100=0.4951, 250=0.45988, 500=0.3914, 1000=0.31312 (USD); Packaging: Cut Tape (CT); Part Status: Active; Drain to Source Voltage (Vdss): 20V; Operating Temperature: -55°C ~ 150°C (TJ); Mounting Type: Surface Mount; Package / Case: PowerPAK® 1212-8; Supplier Device Package: PowerPAK® 1212-8; ComponentLink1URL: http://www.vishay.com/docs/62667/si7615adn.pdf; ComponentLink1Description: http://www.vishay.com/docs/62667/si7615adn.pdf
R1 R6 R7 R11 = RES SMD 10K OHM 1% 1/10W 0603: Manufacturer Part Number: RC0603FR-0710KL; Manufacturer: Yageo; Resistance (Sortable): 10000; Tolerance: ±1%; Power (Watts): 0.1W, 1/10W; Temperature Coefficient: ±100ppm/°C; Supplier 1: Digikey; Datasheets: http://www.yageo.com/documents/recent/PYu-RC_Group_51_RoHS_L_9.pdf; Image: //media.digikey.com/Renders/Yageo%20Renders/0603-(1608-Metric).jpg; Supplier Part Number 1: 311-10.0KHRCT-ND; Operating Temperature: -55°C ~ 155°C
R2 = RES SMD 470K OHM 1% 1/10W 0603: Manufacturer: Yageo; Tolerance: ±1%; Power (Watts): 0.1W, 1/10W; Resistance (Sortable): 470000; Temperature Coefficient: ±100ppm/°C; Manufacturer Part Number: RC0603FR-07470KL; Supplier 1: Digikey; Datasheets: http://www.yageo.com/documents/recent/PYu-RC_Group_51_RoHS_L_9.pdf; Image: //media.digikey.com/Renders/Yageo%20Renders/0603-(1608-Metric).jpg; Supplier Part Number 1: 311-470KHRCT-ND; Operating Temperature: -55°C ~ 155°C
R3 R9 = RES SMD 100K OHM 1% 1/10W 0603: Manufacturer: Yageo; Tolerance: ±1%; Power (Watts): 0.1W, 1/10W; Resistance (Sortable): 100000; Temperature Coefficient: ±100ppm/°C; Manufacturer Part Number: RC0603FR-07100KL; Supplier 1: Digikey; Datasheets: http://www.yageo.com/documents/recent/PYu-RC_Group_51_RoHS_L_9.pdf; Image: //media.digikey.com/Renders/Yageo%20Renders/0603-(1608-Metric).jpg; Supplier Part Number 1: 311-100KHRCT-ND; Operating Temperature: -55°C ~ 155°C
R4 = RES SMD 150K OHM 1% 1/10W 0603: Manufacturer: Yageo; Tolerance: ±1%; Power (Watts): 0.1W, 1/10W; Resistance (Sortable): 150000; Temperature Coefficient: ±100ppm/°C; Manufacturer Part Number: RC0603FR-07150KL; Supplier 1: Digikey; Datasheets: http://www.yageo.com/documents/recent/PYu-RC_Group_51_RoHS_L_9.pdf; Image: //media.digikey.com/Renders/Yageo%20Renders/0603-(1608-Metric).jpg; Supplier Part Number 1: 311-150KHRCT-ND; Operating Temperature: -55°C ~ 155°C
R5 R12 = RES SMD 20K OHM 1% 1/10W 0603: Manufacturer Part Number: RC0603FR-0720KL; Manufacturer: Yageo; Resistance (Sortable): 20000; Tolerance: ±1%; Power (Watts): 0.1W, 1/10W; Temperature Coefficient: ±100ppm/°C; Supplier 1: Digikey; Datasheets: http://www.yageo.com/documents/recent/PYu-RC_Group_51_RoHS_L_9.pdf; Image: //media.digikey.com/Renders/Yageo%20Renders/0603-(1608-Metric).jpg; Supplier Part Number 1: 311-20.0KHRCT-ND; Operating Temperature: -55°C ~ 155°C
R8 = RES SMD 680K OHM 1% 1/10W 0603: Manufacturer: Yageo; Tolerance: ±1%; Power (Watts): 0.1W, 1/10W; Resistance (Sortable): 680000; Temperature Coefficient: ±100ppm/°C; Manufacturer Part Number: RC0603FR-07680KL; Supplier 1: Digikey; Datasheets: http://www.yageo.com/documents/recent/PYu-RC_Group_51_RoHS_L_9.pdf; Image: //media.digikey.com/Renders/Yageo%20Renders/0603-(1608-Metric).jpg; Supplier Part Number 1: 311-680KHRCT-ND; Operating Temperature: -55°C ~ 155°C
R10 = RES SMD 130K OHM 1% 1/10W 0603: Manufacturer: Yageo; Tolerance: ±1%; Power (Watts): 0.1W, 1/10W; Resistance (Sortable): 130000; Temperature Coefficient: ±100ppm/°C; Manufacturer Part Number: RC0603FR-07130KL; Supplier 1: Digikey; Datasheets: http://www.yageo.com/documents/recent/PYu-RC_Group_51_RoHS_L_9.pdf; Image: //media.digikey.com/Renders/Yageo%20Renders/0603-(1608-Metric).jpg; Supplier Part Number 1: 311-130KHRCT-ND; Operating Temperature: -55°C ~ 155°C
SW1 = SWITCH_500SSP1S1M6QEA: SWITCH SLIDE SPDT R/A 5A; Manufacturer: E-Switch; Contact Timing: Not Specified; Switch Function: On-On; Current Rating: 5A (AC/DC); Voltage Rating - AC: 120V; Voltage Rating - DC: 28V; Actuator Type: Standard; Actuator Length: 4.72mm; Actuator Material: Polyamide (PA), Nylon; Switch Travel: 2.16mm; Mechanical Life: 30,000 Cycles; Supplier 1: Digi-Key; Manufacturer Part Number: 500SSP1S1M6QEA; RoHS: RoHS Compliant; Category: Switches; Stock 1: 8402; Pricing 1: 1=2.93, 10=2.808, 25=2.7484, 50=2.39, 100=2.3303, 250=2.27052, 500=1.912, 1000=1.7925, 5000=1.64313 (USD); Packaging: Bulk; Part Status: Active; Circuit: SPDT; Contact Material: Copper Alloy; Contact Finish: Silver; Mounting Type: Through Hole, Right Angle; Termination Style: PC Pin; Features: Epoxy Sealed Terminals; Operating Temperature: -30°C ~ 85°C; Electrical Life: 30,000 Cycles; Operating Force: -; ComponentLink1URL: http://spec_sheets.e-switch.com/specs/T511006.pdf; ComponentLink1Description: http://spec_sheets.e-switch.com/specs/T511006.pdf; Supplier Part Number 1: EG2478-ND
U1 U3 = TPS63070RNM: BUCKBOOST TPS63070RNM, RNM0015A; Manufacturer: Texas Instruments; SymbolCreator: Altium; SizeX_mm: 2.5; SizeY_mm: 3; SizeZ_mm: 1; CompType: IC; U/M: EA; SymbolVersion: 2015-05-01; PartNumber: TPS63070RNM; PackageReference: RNM0015A; PackageDescription: VQFN-HR-15; MountType: SMT; ComponentLink1Description: Datasheet Link; ComponentLink1URL: https://sps06.itg.ti.com/sites/KMS/crossdivteams/altium/docs/ComponentDatasheets/TPS63070_datasheet_23_April2015.pdf; Publisher: Texas Instruments; LatestRevisionDate: 2016-05-12; Alternate Manufacturer: Texas Instruments; Supplier 1: Digi-Key

## Sheet Blink_Blink_Beep_Boop.SchDoc: External Indicators
size A4; SheetNumber: 5; SheetTotal: 6
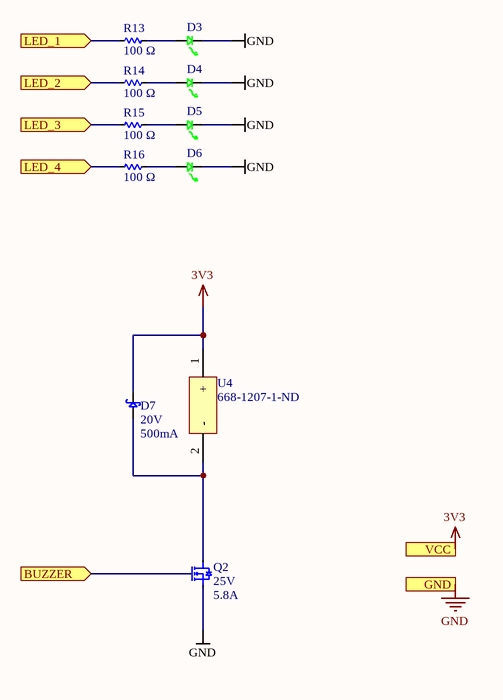
[diagram p3: Blink_Blink_Beep_Boop.SchDoc]

### Parts
D3  GREEN  [0805_Diode]  (value not drawn)
D4  GREEN  [0805_Diode]  (value not drawn)
D5  GREEN  [0805_Diode]  (value not drawn)
D6  GREEN  [0805_Diode]  (value not drawn)
D7  Voltage - DC Reverse (Vr) (Max): 20V  Current - Average Rectified (Io): 500mA  [SOD123]  (hidden comment: SCHOTTKY_MBR0520L)
Q2  Drain to Source Voltage (Vdss): 25V  Current - Continuous Drain (Id) @ 25° C: 5.8A  [3SOT23]  (hidden comment: MOSFET N-CH 60V 1.7A SSOT3)
R13  Resistance: 100 Ω  [R0603]  (hidden comment: __template_resistor)
R14  Resistance: 100 Ω  [R0603]  (hidden comment: __template_resistor)
R15  Resistance: 100 Ω  [R0603]  (hidden comment: __template_resistor)
R16  Resistance: 100 Ω  [R0603]  (hidden comment: __template_resistor)
U4  Supplier Part Number 1: 668-1207-1-ND  [BUZ_SMT-0540-T-7-R]  (hidden comment: BUZ_SMT-0540-T-7-R)

### Ports
BUZZER (in), GND (in), LED_1 (in), LED_2 (in), LED_3 (in), LED_4 (in), VCC (in)

### Nets
3V3: D7.2 U4.1(+) ; port VCC
GND: D3.1 D4.1 D5.1 D6.1 Q2.2 ; port GND  [project net SELF_GND]
BUZZER: Q2.1 ; port BUZZER
LED_1: R13.1 ; port LED_1
LED_2: R14.1 ; port LED_2
LED_3: R15.1 ; port LED_3
LED_4: R16.1 ; port LED_4
NetD3_2: D3.2 R13.2
NetD4_2: D4.2 R14.2
NetD5_2: D5.2 R15.2
NetD6_2: D6.2 R16.2
NetD7_1: D7.1 Q2.3 U4.2(-)

### Notes on the sheet
- Title
- Size:
- Date:
- A4
- Number:
- Time:
- Revision:
- Sheet
- of
- File:

### Library data of the parts
D3-D6 = LED_LY971: LED 0805 GREEN 20MA; Manufacturer: OSRAM Opto Semiconductors Inc; Manufacturer Part Number: LG R971-KN-1; Wavelength - Dominant: 570nm; Wavelength - Peak: 572nm; Millicandela Rating: 26.05mcd; Voltage - Forward (Vf) (Typ): 2.2V; Viewing Angle: 160°; Lens Transparency: Diffused; Lens Color: White; Lens Style/Size: Rectangle with Flat Top, 1.30mm x 1.25mm; Supplier 1: Digi-Key; RoHS: RoHS Compliant; Category: Optoelectronics; Stock 1: 89733; Pricing 1: 1=0.08, 10=0.069, 100=0.0548, 250=0.04796, 500=0.04384 (USD); Packaging: Cut Tape (CT); Color: Green; Package / Case: 0805 (2012 Metric); Supplier Device Package: *; Size / Dimension: 2.00mm L x 1.25mm W; Height (Max): 0.80mm; Mounting Type: Surface Mount; ComponentLink1URL: http://www.osram-os.com/Graphics/XPic9/00078860_0.pdf; ComponentLink1Description: http://www.osram-os.com/Graphics/XPic9/00078860_0.pdf; Supplier Part Number 1: 475-1410-1-ND; Current - Test: 20mA
D7 = SCHOTTKY_MBR0520L: DIODE SCHOTTKY 0.5A 20V SOD-123; Manufacturer: Fairchild Semiconductor; Voltage - Forward (Vf) (Max) @ If: 385mV @ 500mA; Speed: Fast Recovery =< 500ns, > 200mA (Io); Current - Reverse Leakage @ Vr: 250µA @ 20V; Supplier 1: Digi-Key; Manufacturer Part Number: MBR0520L; RoHS: RoHS Compliant; Category: Discrete Semiconductor Products; Stock 1: 217232; Pricing 1: 1=0.63, 10=0.43, 100=0.2024, 250=0.1442, 500=0.11006, 750=0.08603, 1000=0.0759 (USD); Diode Type: Schottky; Reverse Recovery Time (trr): -; Capacitance @ Vr, F: -; Mounting Type: Surface Mount; Package / Case: SOD-123; Supplier Device Package: SOD-123; Packaging: Cut Tape (CT); ComponentLink1URL: http://www.fairchildsemi.com/ds/MB/MBR0520L.pdf; ComponentLink1Description: Datasheet; Supplier Part Number 1: MBR0520LCT-ND
Q2 = NFET_IRFML8244TRPBF: MOSFET N-CH 25V 5.8A SOT23; Manufacturer: International Rectifier; FET Type: MOSFET N-Channel, Metal Oxide; FET Feature: Logic Level Gate; Rds On (Max) @ Id, Vgs: 24 mOhm @ 5.8A, 10V; Vgs(th) (Max) @ Id: 2.35V @ 10µA; Gate Charge (Qg) @ Vgs: 5.4nC @ 10V; Input Capacitance (Ciss) @ Vds: 430pF @ 10V; Power - Max: 1.25W; Supplier 1: Digi-Key; Manufacturer Part Number: IRFML8244TRPBF; RoHS: RoHS Compliant; Category: Discrete Semiconductor Products; Stock 1: 13542; Pricing 1: 1=0.41, 10=0.23, 100=0.1491, 250=0.13548, 500=0.1219, 1000=0.11411 (USD); Mounting Type: Surface Mount; Package / Case: TO-236-3, SC-59, SOT-23-3; Supplier Device Package: SOT-23; Packaging: Cut Tape (CT); ComponentLink1URL: http://www.irf.com/product-info/datasheets/data/irfml8244pbf.pdf; ComponentLink1Description: Datasheet; Supplier Part Number 1: IRFML8244TRPBFCT-ND
R13-R16 = RES SMD 100 OHM 1% 1/10W 0603: Manufacturer Part Number: RC0603FR-07100RL; Manufacturer: Yageo; Tolerance: ±1%; Power (Watts): 0.1W, 1/10W; Resistance (Sortable): 100; Temperature Coefficient: ±100ppm/°C; Supplier 1: Digikey; Datasheets: http://www.yageo.com/documents/recent/PYu-RC_Group_51_RoHS_L_9.pdf; Image: //media.digikey.com/Renders/Yageo%20Renders/0603-(1608-Metric).jpg; Supplier Part Number 1: 311-100HRCT-ND; Operating Temperature: -55°C ~ 155°C
U4 = BUZ_SMT-0540-T-7-R: Peak-Peak Signal Buzzer Single Tone 4kHz Magnetic 2 ~ 4V 78dB @ 3V, 10cm; Manufacturer: PUI Audio, Inc.; Driver Circuitry: Transducer, Externally Driven; Voltage Range: 2 ~ 4V; Current - Supply: 100mA; Port Location: Top; Supplier 1: Digi-Key; Manufacturer Part Number: SMT-0540-T-7-R; RoHS: RoHS Compliant; Category: Audio Products; Stock 1: 12397; Pricing 1: 1=3.99, 10=3.325, 100=2.66, 500=2.3275 (USD); Packaging: Cut Tape (CT); Part Status: Active; Input Type: Peak-Peak Signal; Voltage - Rated: 3V; Frequency: 4kHz; Technology: Magnetic; Operating Mode: Single Tone; Duration: -; Sound Pressure Level: 78dB @ 3V, 10cm; Operating Temperature: -30°C ~ 70°C; Approvals: -; Ratings: -; Mounting Type: Surface Mount; Termination: Solder Pads; Size / Dimension: 5.0mm L x 5.0mm W x 2.1mm H; Height - Seated (Max): *; ComponentLink1URL: http://www.puiaudio.com/pdf/SMT-0540-T-7-R.pdf; ComponentLink1Description: http://www.puiaudio.com/pdf/SMT-0540-T-7-R.pdf

## Sheet ESP8266.SchDoc
size A4
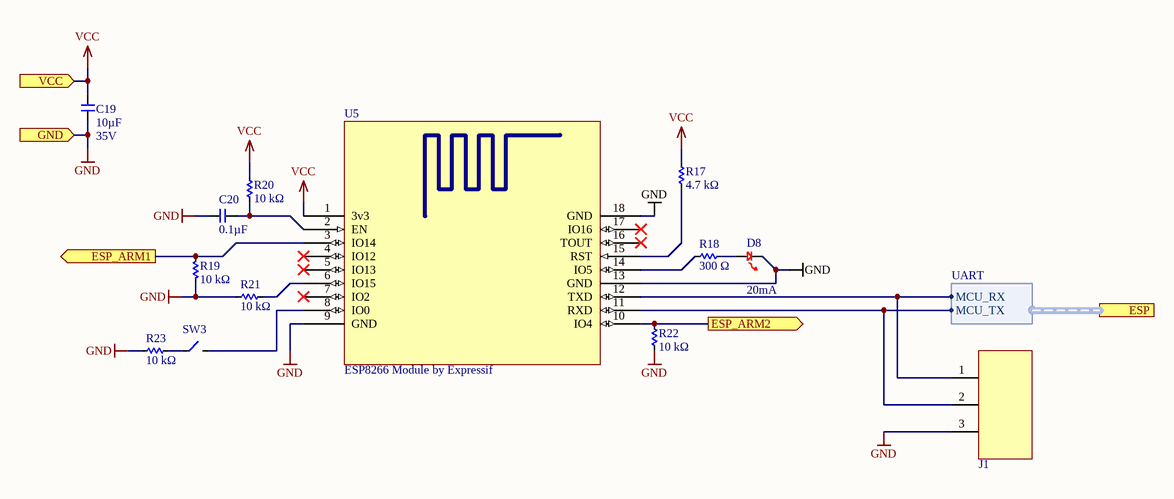
[diagram p4: ESP8266.SchDoc]

### Parts
C19  Capacitance (shorthand): 10µF  Rated Voltage: 35V  [C0603]  (hidden comment: __template_cap)
C20  Capacitance (shorthand): 0.1µF  [C0603]  (hidden comment: __template_cap)
D8  Current - Test: 20mA  [0805_Diode]  (hidden comment: RED)
J1  CONN_1x3_RA_SMT_MALE_TSM-103-01-L-SH  [CONN_1x3_100MIL_RA_SMT]  (value not drawn)
R17  Resistance: 4.7 kΩ  [R0603]  (hidden comment: __template_resistor)
R18  Resistance: 300 Ω  [R0603]  (hidden comment: __template_resistor)
R19  Resistance: 10 kΩ  [R0603]  (hidden comment: __template_resistor)
R20  Resistance: 10 kΩ  [R0603]  (hidden comment: __template_resistor)
R21  Resistance: 10 kΩ  [R0603]  (hidden comment: __template_resistor)
R22  Resistance: 10 kΩ  [R0603]  (hidden comment: __template_resistor)
R23  Resistance: 10 kΩ  [R0603]  (hidden comment: __template_resistor)
SW3  SWITCH_SPST-NO  [SWITCH_B3U-1000P]  (value not drawn)
U5  ESP8266 Module by Expressif  [ESP-WROOM-02]

### Ports
ESP (harness UART), ESP_ARM1 (out), ESP_ARM2 (out), GND (in), VCC (in)

### Harnesses
UART: MCU_RX, MCU_TX

### Nets
GND: C19.2 C20.1 D8.1 J1.3 R19.2 R21.2 R22.2 R23.2 U5.9(GND) U5.13(GND) U5.18(GND) ; port GND  [project net SELF_GND]
VCC: C19.1 R17.2 R20.2 U5.1(3v3) ; port VCC  [project net 3V3]
NetC20_2: C20.2 R20.1 U5.2(EN)
NetD8_2: D8.2 R18.2
NetJ1_1: J1.1 U5.12(TXD) ; port ESP.MCU_RX
NetJ1_2: J1.2 U5.11(RXD) ; port ESP.MCU_TX
NetR17_1: R17.1 U5.15(RST)
NetR18_1: R18.1 U5.14(IO5)
NetR19_1: R19.1 U5.3(IO14) ; port ESP_ARM1
NetR21_1: R21.1 U5.6(IO15)
NetR22_1: R22.1 U5.10(IO4) ; port ESP_ARM2
NetR23_1: R23.1 SW3.1
NetSW3_2: SW3.2 U5.8(IO0)

Not connected (* = marked no-connect by the designer): U5 4(IO12)* 5(IO13)* 7(IO2)* 16(TOUT)* 17(IO16)*

### Notes on the sheet
- Title
- Size:
- Date:
- A4
- Number:
- Time:
- Revision:
- Sheet
- of
- File:

### Library data of the parts
C19 = CAP CER 10UF 35V X5R 0603 20%: as C8 on sheet Sensors; Description: CAP CER 10UF 35V X5R 0603 20%; Supplier 1: Digikey; Supplier Part Number 1: 490-13248-1-ND
C20 = CAP CER 0603 0.1µF X7R 50V 10%: Manufacturer: Murata Electronics North America; Rated Voltage: 50V; Capacitance - pF (Machine readable): 100000; type: capacitor; Dielectric: X7R; Supplier 1: Digikey; Supplier Part Number 1: 490-1519-1-ND
D8 = LED_LY974: as D9 on sheet Salmon; Supplier 1: Digi-Key; RoHS: RoHS Compliant; Category: Optoelectronics; Stock 1: 66379; Pricing 1: 1=0.08, 10=0.07, 100=0.0559, 250=0.04892, 500=0.04472 (USD); Packaging: Cut Tape (CT); Color: Red; Package / Case: 0805 (2012 Metric); Supplier Device Package: *; Size / Dimension: 2.00mm L x 1.25mm W; Height (Max): 0.80mm; Mounting Type: Surface Mount; ComponentLink1URL: http://www.osram-os.com/Graphics/XPic8/00078869_0.pdf; ComponentLink1Description: http://www.osram-os.com/Graphics/XPic8/00078869_0.pdf; Supplier Part Number 1: 475-1415-1-ND
J1 = CONN_1x3_RA_SMT_MALE_TSM-103-01-L-SH: CONN HEADER 3POS .100" SNGL SMD; Manufacturer: Samtec Inc.; Pitch - Mating: 0.100" (2.54mm); Style: Board to Board or Cable; Shrouding: Unshrouded; Number of Positions: 3; Number of Positions Loaded: All; Contact Length - Mating: 0.230" (5.84mm); Material Flammability Rating: UL94 V-0; Supplier 1: Digi-Key; Manufacturer Part Number: TSM-103-01-L-SH; RoHS: RoHS Compliant; Category: Connectors, Interconnects; Stock 1: 1775; Pricing 1: 1=0.56, 10=0.525, 100=0.4025, 500=0.35, 1000=0.28875, 5000=0.25375, 10000=0.23625 (USD); Packaging: Tube; Part Status: Active; Connector Type: Header; Contact Type: Male Pin; Number of Rows: 1; Row Spacing - Mating: -; Mounting Type: Surface Mount, Right Angle; Termination: Solder; Fastening Type: -; Contact Length - Post: -; Overall Contact Length: -; Insulation Height: 0.120" (3.05mm); Contact Shape: Square; Contact Finish - Mating: Gold; Contact Finish Thickness - Mating: 10µin (0.25µm); Contact Finish - Post: Tin; Contact Material: Phosphor Bronze; Insulation Material: Liquid Crystal Polymer (LCP); Features: -; Operating Temperature: -55°C ~ 125°C; Ingress Protection: -; Insulation Color: Black; Current Rating: -; Voltage Rating: -; Mated Stacking Heights: -; Contact Finish Thickness - Post: -; Applications: -; ComponentLink1URL: http://suddendocs.samtec.com/prints/tsm-1xx-xx-xxx-xx-x-xxx-x-mkt.pdf; ComponentLink1Description: http://suddendocs.samtec.com/prints/tsm-1xx-xx-xxx-xx-x-xxx-x-mkt.pdf; Supplier Part Number 1: SAM10270-ND
R17 = RES SMD 4.7K OHM 1% 1/10W 0603: Manufacturer: Yageo; Manufacturer Part Number: RC0603FR-074K7L; Resistance (Sortable): 4700; Tolerance: ±1%; Power (Watts): 0.1W, 1/10W; Temperature Coefficient: ±100ppm/°C; Supplier 1: Digikey; Supplier Part Number 1: 311-4.70KHRCT-ND; Datasheets: http://www.yageo.com/documents/recent/PYu-RC_Group_51_RoHS_L_9.pdf; Image: //media.digikey.com/Renders/Yageo%20Renders/0603-(1608-Metric).jpg; Operating Temperature: -55°C ~ 155°C
R18 = RES SMD 300 OHM 1% 1/10W 0603: Manufacturer: Yageo; Manufacturer Part Number: RC0603FR-07300RL; Resistance (Sortable): 300; Tolerance: ±1%; Power (Watts): 0.1W, 1/10W; Temperature Coefficient: ±100ppm/°C; Supplier 1: Digikey; Supplier Part Number 1: 311-300HRCT-ND; Datasheets: http://www.yageo.com/documents/recent/PYu-RC_Group_51_RoHS_L_9.pdf; Image: //media.digikey.com/Renders/Yageo%20Renders/0603-(1608-Metric).jpg; Operating Temperature: -55°C ~ 155°C
R19-R23 = RES SMD 10K OHM 1% 1/10W 0603: Manufacturer: Yageo; Manufacturer Part Number: RC0603FR-0710KL; Resistance (Sortable): 10000; Tolerance: ±1%; Power (Watts): 0.1W, 1/10W; Temperature Coefficient: ±100ppm/°C; Supplier 1: Digikey; Supplier Part Number 1: 311-10.0KHRCT-ND; Datasheets: http://www.yageo.com/documents/recent/PYu-RC_Group_51_RoHS_L_9.pdf; Image: //media.digikey.com/Renders/Yageo%20Renders/0603-(1608-Metric).jpg; Operating Temperature: -55°C ~ 155°C
SW3 = SWITCH_SPST-NO: SWITCH TACTILE SPST-NO 0.05A 12V; Manufacturer: Omron Electronics Inc-EMC Div; Manufacturer Part Number: B3U-1000P; Switch Function: Off-Mom; Actuator Type: Standard; Actuator Height off PCB, from Pins: 1.60mm; Actuator Orientation: Top Actuated; Outline: 3.00mm x 2.50mm; Illumination: Non-Illuminated; Operating Force: 153gf; Ingress Protection: Dust Proof; Switch Travel: 0.15mm; Mechanical Life: 200,000 Cycles; Contact Rating @ Voltage: 0.05A @ 12VDC; Supplier 1: Digi-Key; RoHS: RoHS Compliant; Category: Switches; Stock 1: 16437; Pricing 1: 1=1.25, 10=1.201, 25=1.1332, 50=0.997, 100=0.9064, 250=0.86108, 500=0.83842, 1000=0.65714 (USD); Circuit: SPST-NO; Mounting Type: Surface Mount; Termination Style: SMD (SMT) Tab; Illumination Voltage (Nominal): -; Illumination Type, Color: -; Features: -; Packaging: Cut Tape (CT); Actuator Material: -; Operating Temperature: -25°C ~ 70°C; ComponentLink1URL: http://components.omron.com/components/web/pdflib.nsf/0/2DD3893C7DD33E9E862572900079E9D6/$file/B3U_1110.pdf; ComponentLink1Description: http://components.omron.com/components/web/pdflib.nsf/0/2DD3893C7DD33E9E862572900079E9D6/$file/B3U_1110.pdf; Supplier Part Number 1: SW1020CT-ND
U5 = ESP-WROOM-02: IC: ESP8266-EX; Vendor: Expressif Systems; LatestReviewer: Tim Vrakas; Published: 14-Apr-2015; Publisher: SSI; LatestRevisionData: 12/20/2017; LatestRevisionNote: WROOM Module